# Altium project PROC154E3_SCH.PrjPcb (part 16 of 60)
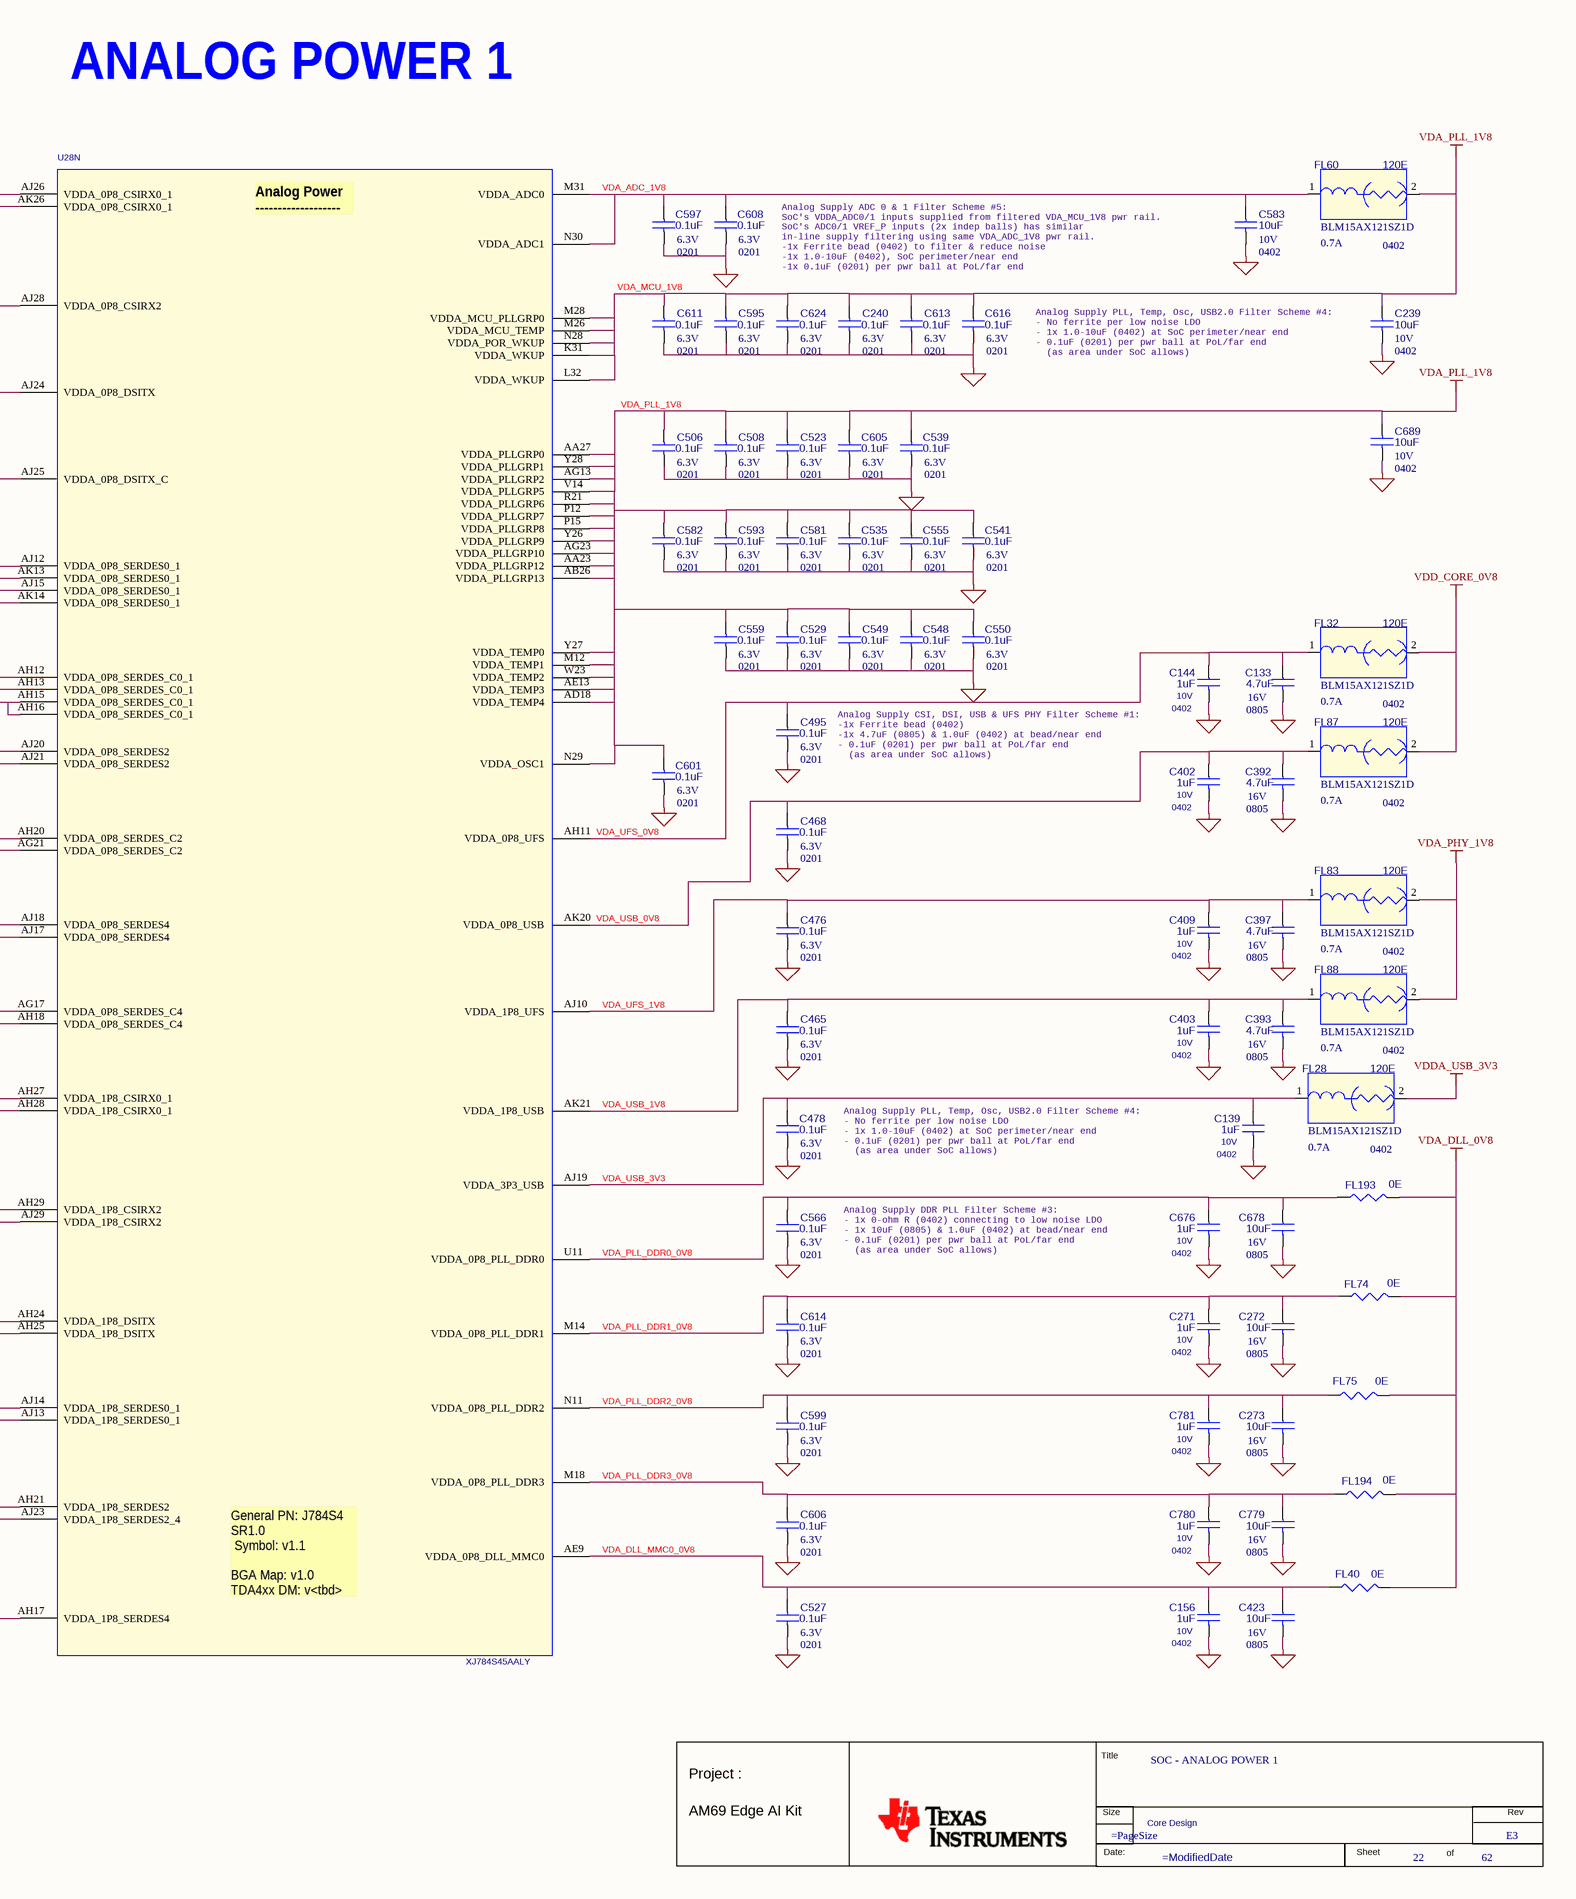
[diagram p207: 22. SOC ANALOG POWER 1.SchDoc, right]

## Sheet 22. SOC ANALOG POWER 1.SchDoc: SOC - ANALOG POWER 1 (continued)

### Library data of the parts (continued)
C616 = CAP_Dup1: CAP CERAMIC 0.1uF 6.3V 10% X7S AUTO 0201; Part Reference: C616; Mistral Part No: 120018100001-R; Mfr_name: MURATA; Mfr_part_number: GCM033C70J104KE02D; Part_type: CAPACITORS\CERAMIC; Project: TI_J7_SVB-DUT; Wattage: NA; Customs_HS_Code: 85322990; Custom_Duty: 15%; Value: 0.1uF; PCB Footprint: CAP0201_0-5; Footprint Ref: CAP0201_0-5; Tolerance: 10%; Distributor_name: NA; Distributor_part_number: NA; Library Ref: CAP; Height: 0.33MM; Weight: NA; Temperature: -55°C+125°C; Datasheet: Y:\MIS_DATABASE\DATASHEETS\CAPACITORS\MURATA-GCM-SER.PDF; Crtd /date: MANIRAJA/011018; Chkd/date: MANIRAJA/011018; MECHANICAL 3D STEP FILE: CAP0201_0-5; Library Path: Y:\MIS_DATABASE\Library\ALTIUM_TOOL\SCHEMATICS_PARTS\MS_DISCRETE_Library.schlib; Footprint Path: Y:\MIS_DATABASE\Library\ALTIUM_TOOL\PCB_FOOTPRINTS\Altium_Footprint_Lib.PcbLib; Manufacturer: MURATA
C624 = CAP_Dup1: CAP CERAMIC 0.1uF 6.3V 10% X7S AUTO 0201; Part Reference: C624; Part_type: CAPACITORS\CERAMIC; Mfr_part_number: GCM033C70J104KE02D; Mfr_name: MURATA; Mistral Part No: 120018100001-R; Custom_Duty: 15%; Customs_HS_Code: 85322990; Wattage: NA; Project: TI_J7_SVB-DUT; Value: 0.1uF; PCB Footprint: CAP0201_0-5; Footprint Path: Y:\MIS_DATABASE\Library\ALTIUM_TOOL\PCB_FOOTPRINTS\Altium_Footprint_Lib.PcbLib; Library Path: Y:\MIS_DATABASE\Library\ALTIUM_TOOL\SCHEMATICS_PARTS\MS_DISCRETE_Library.schlib; MECHANICAL 3D STEP FILE: CAP0201_0-5; Chkd/date: MANIRAJA/011018; Crtd /date: MANIRAJA/011018; Datasheet: Y:\MIS_DATABASE\DATASHEETS\CAPACITORS\MURATA-GCM-SER.PDF; Temperature: -55°C+125°C; Weight: NA; Height: 0.33MM; Library Ref: CAP; Distributor_part_number: NA; Distributor_name: NA; Tolerance: 10%; Footprint Ref: CAP0201_0-5; Manufacturer: MURATA
C676 = CAP_Dup1: CAP CERAMIC 1uF 10V 10% X7S AUTO 0402; Part Reference: C676; Mistral Part No: 120018090021-R; Mfr_name: MURATA; Mfr_part_number: GCM155C71A105KE38D; Part_type: CAPACITORS\CERAMIC; Project: SMART-M_SCRIPTALK_PB; Wattage: NA; Customs_HS_Code: 85322990; Custom_Duty: 15%; Value: 1uF; PCB Footprint: CAP0402_0-75; Footprint Ref: CAP0402_0-75; Tolerance: 10%; Distributor_name: DIGIKEY; Distributor_part_number: 490-13409-1-ND; Library Ref: CAP; Height: 0.70MM; Weight: 6mg; Temperature: -55°C+125°C; Datasheet: Y:\MIS_DATABASE\DATASHEETS\CAPACITORS\MURATA-GCM-SER.PDF; Crtd /date: ALVY/100918; Chkd/date: MANIRAJA/100918; MECHANICAL 3D STEP FILE: CAP0402_0-75; Library Path: Y:\MIS_DATABASE\Library\ALTIUM_TOOL\SCHEMATICS_PARTS\MS_DISCRETE_Library.schlib; Footprint Path: Y:\MIS_DATABASE\Library\ALTIUM_TOOL\PCB_FOOTPRINTS\Altium_Footprint_Lib.PcbLib; Manufacturer: MURATA
C678 = CAP_Dup1: CAP CERAMIC 10uF 16V 10% X5R 0805; Part Reference: C678; Direct Alternate_mfr_part_number: C2012X7S1C106K125AC; Direct Alternate_mfr_name: TDK; Automotive Alternate_mfr_part_number: CGA4J1X7S1C106K125AC; Mistral Part No: 120009030205-R; Mfr_name: MURATA; Mfr_part_number: GRM21BR61C106KE15L; Part_type: CAPACITORS\CERAMIC; Project: VOCERA; Wattage: NA; Customs_HS_Code: 85322990; Custom_Duty: 15%; Value: 10uF; PCB Footprint: CAP0805_1-5; Automotive Alternate_mfr_name: TDK; Footprint Ref: CAP0805_1-25; Tolerance: 10%; Distributor_name: DIGIKEY; Distributor_part_number: 490-3886-1-ND; Library Ref: CAP; Height: 1.35MM; Weight: 9.5mg; Temperature: -55°C+85°C; Datasheet: Y:\MIS_DATABASE\DATASHEETS\CAPACITORS\MURATA-GXX-SER_NOV17.PDF; Crtd /date: MAZHAR/150506; Chkd/date: SHREESHAIL/220506; MECHANICAL 3D STEP FILE: CAP0805_1-5; Library Path: Y:\MIS_DATABASE\Library\ALTIUM_TOOL\SCHEMATICS_PARTS\MS_DISCRETE_Library.schlib; Footprint Path: Y:\MIS_DATABASE\Library\ALTIUM_TOOL\PCB_FOOTPRINTS\Altium_Footprint_Lib.PcbLib; Manufacturer: MURATA
C689 = CAP_Dup1: CAP CERAMIC 10uF 10V 20% X5R 0402; Part Reference: C689; Part_type: CAPACITORS\CERAMIC; Mfr_part_number: GRM155R61A106ME11D; Mfr_name: MURATA; Mistral Part No: 120013110019-R; Custom_Duty: 15%; Customs_HS_Code: 85322990; Wattage: NA; Project: QCS610_NANOSOM; Value: 10uF; PCB Footprint: CAP0402_0-75; Footprint Path: Y:\MIS_DATABASE\Library\ALTIUM_TOOL\PCB_FOOTPRINTS\Altium_Footprint_Lib.PcbLib; Library Path: Y:\MIS_DATABASE\Library\ALTIUM_TOOL\SCHEMATICS_PARTS\MS_DISCRETE_Library.schlib; MECHANICAL 3D STEP FILE: CAP0402_0-75; Chkd/date: MANIRAJA/300520; Crtd /date: ALVY/260520; Datasheet: Y:\MIS_DATABASE\DATASHEETS\CAPACITORS\MURATA-GXX-SER_NOV17.PDF; Temperature: -55°C+85°C; Weight: 3.1mg; Height: 0.55MM; Library Ref: CAP; Distributor_part_number: 490-GRM155R61A106ME11DTR-ND; Distributor_name: DIGIKEY; Tolerance: 20%; Footprint Ref: CAP0402_0-75; Manufacturer: MURATA
C779 = CAP_Dup1: CAP CERAMIC 10uF 16V 10% X5R 0805; Part Reference: C779; Direct Alternate_mfr_part_number: C2012X7S1C106K125AC; Direct Alternate_mfr_name: TDK; Automotive Alternate_mfr_part_number: CGA4J1X7S1C106K125AC; Mistral Part No: 120009030205-R; Mfr_name: MURATA; Mfr_part_number: GRM21BR61C106KE15L; Part_type: CAPACITORS\CERAMIC; Project: VOCERA; Wattage: NA; Customs_HS_Code: 85322990; Custom_Duty: 15%; Value: 10uF; PCB Footprint: CAP0805_1-5; Automotive Alternate_mfr_name: TDK; Footprint Ref: CAP0805_1-25; Tolerance: 10%; Distributor_name: DIGIKEY; Distributor_part_number: 490-3886-1-ND; Library Ref: CAP; Height: 1.35MM; Weight: 9.5mg; Temperature: -55°C+85°C; Datasheet: Y:\MIS_DATABASE\DATASHEETS\CAPACITORS\MURATA-GXX-SER_NOV17.PDF; Crtd /date: MAZHAR/150506; Chkd/date: SHREESHAIL/220506; MECHANICAL 3D STEP FILE: CAP0805_1-5; Library Path: Y:\MIS_DATABASE\Library\ALTIUM_TOOL\SCHEMATICS_PARTS\MS_DISCRETE_Library.schlib; Footprint Path: Y:\MIS_DATABASE\Library\ALTIUM_TOOL\PCB_FOOTPRINTS\Altium_Footprint_Lib.PcbLib; Manufacturer: MURATA
C780 = CAP_Dup1: CAP CERAMIC 1uF 10V 10% X7S AUTO 0402; Part Reference: C780; Part_type: CAPACITORS\CERAMIC; Mfr_part_number: GCM155C71A105KE38D; Mfr_name: MURATA; Mistral Part No: 120018090021-R; Custom_Duty: 15%; Customs_HS_Code: 85322990; Wattage: NA; Project: SMART-M_SCRIPTALK_PB; Value: 1uF; PCB Footprint: CAP0402_0-75; Footprint Path: Y:\MIS_DATABASE\Library\ALTIUM_TOOL\PCB_FOOTPRINTS\Altium_Footprint_Lib.PcbLib; Library Path: Y:\MIS_DATABASE\Library\ALTIUM_TOOL\SCHEMATICS_PARTS\MS_DISCRETE_Library.schlib; MECHANICAL 3D STEP FILE: CAP0402_0-75; Chkd/date: MANIRAJA/100918; Crtd /date: ALVY/100918; Datasheet: Y:\MIS_DATABASE\DATASHEETS\CAPACITORS\MURATA-GCM-SER.PDF; Temperature: -55°C+125°C; Weight: 6mg; Height: 0.70MM; Library Ref: CAP; Distributor_part_number: 490-13409-1-ND; Distributor_name: DIGIKEY; Tolerance: 10%; Footprint Ref: CAP0402_0-75; Manufacturer: MURATA
C781 = CAP_Dup1: CAP CERAMIC 1uF 10V 10% X7S AUTO 0402; Part Reference: C781; Mistral Part No: 120018090021-R; Mfr_name: MURATA; Mfr_part_number: GCM155C71A105KE38D; Part_type: CAPACITORS\CERAMIC; Project: SMART-M_SCRIPTALK_PB; Wattage: NA; Customs_HS_Code: 85322990; Custom_Duty: 15%; Value: 1uF; PCB Footprint: CAP0402_0-75; Footprint Ref: CAP0402_0-75; Tolerance: 10%; Distributor_name: DIGIKEY; Distributor_part_number: 490-13409-1-ND; Library Ref: CAP; Height: 0.70MM; Weight: 6mg; Temperature: -55°C+125°C; Datasheet: Y:\MIS_DATABASE\DATASHEETS\CAPACITORS\MURATA-GCM-SER.PDF; Crtd /date: ALVY/100918; Chkd/date: MANIRAJA/100918; MECHANICAL 3D STEP FILE: CAP0402_0-75; Library Path: Y:\MIS_DATABASE\Library\ALTIUM_TOOL\SCHEMATICS_PARTS\MS_DISCRETE_Library.schlib; Footprint Path: Y:\MIS_DATABASE\Library\ALTIUM_TOOL\PCB_FOOTPRINTS\Altium_Footprint_Lib.PcbLib; Manufacturer: MURATA
FL23 = EMIFILTER_IND: IND FERRITE BEAD CHIP 120E 700mA 0402; Part Reference: FL23; Automotive Alternate_mfr_part_number: MPZ1608S121ATDH5; Automotive Alternate_mfr_name: TDK; Direct Alternate_mfr_part_number: MPZ1608S121ATAH0; Mistral Part No: 130022010017-R; Mfr_name: MURATA; Part_type: INDUCTOR; Project: J7AHP_PROTO_BRD; Tolerance: 25%; Voltage: NA; Customs_HS_Code: 85437099; Custom_Duty: 24%; Value: 120E; PCB Footprint: EMIFIL_BLM15A_0402_0-6; Direct Alternate_mfr_name: TDK; Footprint Ref: EMIFIL_BLM15A_0402_0-6; Wattage: NA; Distributor_name: DIGIKEY; Distributor_part_number: 490-16510-1-ND; Library Ref: EMIFILTER_IND; Height: 0.55MM; Weight: 1mg; Temperature: -55°C+125°C; Datasheet: Y:\MIS_DATABASE\DATASHEETS\DISCRETES\INDUCTORS\BLM15-SZ1D-SER.PDF; Crtd /date: TAMILARASU/170122; Chkd/date: MANIRAJA/170122; MECHANICAL 3D STEP FILE: EMIFIL_BLM15A_0402_0-6; Library Path: Y:\MIS_DATABASE\Library\ALTIUM_TOOL\SCHEMATICS_PARTS\MS_FILTER_Library.schlib; Footprint Path: Y:\MIS_DATABASE\Library\ALTIUM_TOOL\PCB_FOOTPRINTS\Altium_Footprint_Lib.PcbLib; Manufacturer: MURATA
FL24 = EMIFILTER_IND: IND FERRITE BEAD CHIP 120E 700mA 0402; Part Reference: FL24; Part_type: INDUCTOR; Mfr_name: MURATA; Mistral Part No: 130022010017-R; Direct Alternate_mfr_name: TDK; Direct Alternate_mfr_part_number: MPZ1608S121ATAH0; Automotive Alternate_mfr_part_number: MPZ1608S121ATDH5; Custom_Duty: 24%; Customs_HS_Code: 85437099; Wattage: NA; Tolerance: 25%; Project: J7AHP_PROTO_BRD; Value: 120E; PCB Footprint: EMIFIL_BLM15A_0402_0-6; Footprint Path: Y:\MIS_DATABASE\Library\ALTIUM_TOOL\PCB_FOOTPRINTS\Altium_Footprint_Lib.PcbLib; Library Path: Y:\MIS_DATABASE\Library\ALTIUM_TOOL\SCHEMATICS_PARTS\MS_FILTER_Library.schlib; MECHANICAL 3D STEP FILE: EMIFIL_BLM15A_0402_0-6; Chkd/date: MANIRAJA/170122; Crtd /date: TAMILARASU/170122; Datasheet: Y:\MIS_DATABASE\DATASHEETS\DISCRETES\INDUCTORS\BLM15-SZ1D-SER.PDF; Temperature: -55°C+125°C; Weight: 1mg; Height: 0.55MM; Library Ref: EMIFILTER_IND; Distributor_part_number: 490-16510-1-ND; Distributor_name: DIGIKEY; Voltage: NA; Footprint Ref: EMIFIL_BLM15A_0402_0-6; Automotive Alternate_mfr_name: TDK; Manufacturer: MURATA
FL25 = EMIFILTER_IND: IND FERRITE BEAD CHIP 120E 700mA 0402; Part Reference: FL25; Automotive Alternate_mfr_part_number: MPZ1608S121ATDH5; Automotive Alternate_mfr_name: TDK; Direct Alternate_mfr_part_number: MPZ1608S121ATAH0; Mistral Part No: 130022010017-R; Mfr_name: MURATA; Part_type: INDUCTOR; Project: J7AHP_PROTO_BRD; Tolerance: 25%; Voltage: NA; Customs_HS_Code: 85437099; Custom_Duty: 24%; Value: 120E; PCB Footprint: EMIFIL_BLM15A_0402_0-6; Direct Alternate_mfr_name: TDK; Footprint Ref: EMIFIL_BLM15A_0402_0-6; Wattage: NA; Distributor_name: DIGIKEY; Distributor_part_number: 490-16510-1-ND; Library Ref: EMIFILTER_IND; Height: 0.55MM; Weight: 1mg; Temperature: -55°C+125°C; Datasheet: Y:\MIS_DATABASE\DATASHEETS\DISCRETES\INDUCTORS\BLM15-SZ1D-SER.PDF; Crtd /date: TAMILARASU/170122; Chkd/date: MANIRAJA/170122; MECHANICAL 3D STEP FILE: EMIFIL_BLM15A_0402_0-6; Library Path: Y:\MIS_DATABASE\Library\ALTIUM_TOOL\SCHEMATICS_PARTS\MS_FILTER_Library.schlib; Footprint Path: Y:\MIS_DATABASE\Library\ALTIUM_TOOL\PCB_FOOTPRINTS\Altium_Footprint_Lib.PcbLib; Manufacturer: MURATA
FL26 = EMIFILTER_IND: IND FERRITE BEAD CHIP 120E 700mA 0402; Part Reference: FL26; Automotive Alternate_mfr_part_number: MPZ1608S121ATDH5; Automotive Alternate_mfr_name: TDK; Direct Alternate_mfr_part_number: MPZ1608S121ATAH0; Mistral Part No: 130022010017-R; Mfr_name: MURATA; Part_type: INDUCTOR; Project: J7AHP_PROTO_BRD; Tolerance: 25%; Voltage: NA; Customs_HS_Code: 85437099; Custom_Duty: 24%; Value: 120E; PCB Footprint: EMIFIL_BLM15A_0402_0-6; Direct Alternate_mfr_name: TDK; Footprint Ref: EMIFIL_BLM15A_0402_0-6; Wattage: NA; Distributor_name: DIGIKEY; Distributor_part_number: 490-16510-1-ND; Library Ref: EMIFILTER_IND; Height: 0.55MM; Weight: 1mg; Temperature: -55°C+125°C; Datasheet: Y:\MIS_DATABASE\DATASHEETS\DISCRETES\INDUCTORS\BLM15-SZ1D-SER.PDF; Crtd /date: TAMILARASU/170122; Chkd/date: MANIRAJA/170122; MECHANICAL 3D STEP FILE: EMIFIL_BLM15A_0402_0-6; Library Path: Y:\MIS_DATABASE\Library\ALTIUM_TOOL\SCHEMATICS_PARTS\MS_FILTER_Library.schlib; Footprint Path: Y:\MIS_DATABASE\Library\ALTIUM_TOOL\PCB_FOOTPRINTS\Altium_Footprint_Lib.PcbLib; Manufacturer: MURATA
FL27 = EMIFILTER_IND: IND FERRITE BEAD CHIP 120E 700mA 0402; Part Reference: FL27; Automotive Alternate_mfr_part_number: MPZ1608S121ATDH5; Automotive Alternate_mfr_name: TDK; Direct Alternate_mfr_part_number: MPZ1608S121ATAH0; Mistral Part No: 130022010017-R; Mfr_name: MURATA; Part_type: INDUCTOR; Project: J7AHP_PROTO_BRD; Tolerance: 25%; Voltage: NA; Customs_HS_Code: 85437099; Custom_Duty: 24%; Value: 120E; PCB Footprint: EMIFIL_BLM15A_0402_0-6; Direct Alternate_mfr_name: TDK; Footprint Ref: EMIFIL_BLM15A_0402_0-6; Wattage: NA; Distributor_name: DIGIKEY; Distributor_part_number: 490-16510-1-ND; Library Ref: EMIFILTER_IND; Height: 0.55MM; Weight: 1mg; Temperature: -55°C+125°C; Datasheet: Y:\MIS_DATABASE\DATASHEETS\DISCRETES\INDUCTORS\BLM15-SZ1D-SER.PDF; Crtd /date: TAMILARASU/170122; Chkd/date: MANIRAJA/170122; MECHANICAL 3D STEP FILE: EMIFIL_BLM15A_0402_0-6; Library Path: Y:\MIS_DATABASE\Library\ALTIUM_TOOL\SCHEMATICS_PARTS\MS_FILTER_Library.schlib; Footprint Path: Y:\MIS_DATABASE\Library\ALTIUM_TOOL\PCB_FOOTPRINTS\Altium_Footprint_Lib.PcbLib; Manufacturer: MURATA
FL28 = EMIFILTER_IND: IND FERRITE BEAD CHIP 120E 700mA 0402; Part Reference: FL28; Automotive Alternate_mfr_part_number: MPZ1608S121ATDH5; Automotive Alternate_mfr_name: TDK; Direct Alternate_mfr_part_number: MPZ1608S121ATAH0; Mistral Part No: 130022010017-R; Mfr_name: MURATA; Part_type: INDUCTOR; Project: J7AHP_PROTO_BRD; Tolerance: 25%; Voltage: NA; Customs_HS_Code: 85437099; Custom_Duty: 24%; Value: 120E; PCB Footprint: EMIFIL_BLM15A_0402_0-6; Direct Alternate_mfr_name: TDK; Footprint Ref: EMIFIL_BLM15A_0402_0-6; Wattage: NA; Distributor_name: DIGIKEY; Distributor_part_number: 490-16510-1-ND; Library Ref: EMIFILTER_IND; Height: 0.55MM; Weight: 1mg; Temperature: -55°C+125°C; Datasheet: Y:\MIS_DATABASE\DATASHEETS\DISCRETES\INDUCTORS\BLM15-SZ1D-SER.PDF; Crtd /date: TAMILARASU/170122; Chkd/date: MANIRAJA/170122; MECHANICAL 3D STEP FILE: EMIFIL_BLM15A_0402_0-6; Library Path: Y:\MIS_DATABASE\Library\ALTIUM_TOOL\SCHEMATICS_PARTS\MS_FILTER_Library.schlib; Footprint Path: Y:\MIS_DATABASE\Library\ALTIUM_TOOL\PCB_FOOTPRINTS\Altium_Footprint_Lib.PcbLib; Manufacturer: MURATA
FL29 = EMIFILTER_IND: IND FERRITE BEAD CHIP 120E 700mA 0402; Part Reference: FL29; Automotive Alternate_mfr_part_number: MPZ1608S121ATDH5; Automotive Alternate_mfr_name: TDK; Direct Alternate_mfr_part_number: MPZ1608S121ATAH0; Mistral Part No: 130022010017-R; Mfr_name: MURATA; Part_type: INDUCTOR; Project: J7AHP_PROTO_BRD; Tolerance: 25%; Voltage: NA; Customs_HS_Code: 85437099; Custom_Duty: 24%; Value: 120E; PCB Footprint: EMIFIL_BLM15A_0402_0-6; Direct Alternate_mfr_name: TDK; Footprint Ref: EMIFIL_BLM15A_0402_0-6; Wattage: NA; Distributor_name: DIGIKEY; Distributor_part_number: 490-16510-1-ND; Library Ref: EMIFILTER_IND; Height: 0.55MM; Weight: 1mg; Temperature: -55°C+125°C; Datasheet: Y:\MIS_DATABASE\DATASHEETS\DISCRETES\INDUCTORS\BLM15-SZ1D-SER.PDF; Crtd /date: TAMILARASU/170122; Chkd/date: MANIRAJA/170122; MECHANICAL 3D STEP FILE: EMIFIL_BLM15A_0402_0-6; Library Path: Y:\MIS_DATABASE\Library\ALTIUM_TOOL\SCHEMATICS_PARTS\MS_FILTER_Library.schlib; Footprint Path: Y:\MIS_DATABASE\Library\ALTIUM_TOOL\PCB_FOOTPRINTS\Altium_Footprint_Lib.PcbLib; Manufacturer: MURATA
FL30 = EMIFILTER_IND: IND FERRITE BEAD CHIP 120E 700mA 0402; Part Reference: FL30; Part_type: INDUCTOR; Mfr_name: MURATA; Mistral Part No: 130022010017-R; Direct Alternate_mfr_name: TDK; Direct Alternate_mfr_part_number: MPZ1608S121ATAH0; Automotive Alternate_mfr_part_number: MPZ1608S121ATDH5; Custom_Duty: 24%; Customs_HS_Code: 85437099; Wattage: NA; Tolerance: 25%; Project: J7AHP_PROTO_BRD; Value: 120E; PCB Footprint: EMIFIL_BLM15A_0402_0-6; Footprint Path: Y:\MIS_DATABASE\Library\ALTIUM_TOOL\PCB_FOOTPRINTS\Altium_Footprint_Lib.PcbLib; Library Path: Y:\MIS_DATABASE\Library\ALTIUM_TOOL\SCHEMATICS_PARTS\MS_FILTER_Library.schlib; MECHANICAL 3D STEP FILE: EMIFIL_BLM15A_0402_0-6; Chkd/date: MANIRAJA/170122; Crtd /date: TAMILARASU/170122; Datasheet: Y:\MIS_DATABASE\DATASHEETS\DISCRETES\INDUCTORS\BLM15-SZ1D-SER.PDF; Temperature: -55°C+125°C; Weight: 1mg; Height: 0.55MM; Library Ref: EMIFILTER_IND; Distributor_part_number: 490-16510-1-ND; Distributor_name: DIGIKEY; Voltage: NA; Footprint Ref: EMIFIL_BLM15A_0402_0-6; Automotive Alternate_mfr_name: TDK; Manufacturer: MURATA
FL31 = EMIFILTER_IND: IND FERRITE BEAD CHIP 120E 700mA 0402; Part Reference: FL31; Part_type: INDUCTOR; Mfr_name: MURATA; Mistral Part No: 130022010017-R; Direct Alternate_mfr_name: TDK; Direct Alternate_mfr_part_number: MPZ1608S121ATAH0; Automotive Alternate_mfr_part_number: MPZ1608S121ATDH5; Custom_Duty: 24%; Customs_HS_Code: 85437099; Wattage: NA; Tolerance: 25%; Project: J7AHP_PROTO_BRD; Value: 120E; PCB Footprint: EMIFIL_BLM15A_0402_0-6; Footprint Path: Y:\MIS_DATABASE\Library\ALTIUM_TOOL\PCB_FOOTPRINTS\Altium_Footprint_Lib.PcbLib; Library Path: Y:\MIS_DATABASE\Library\ALTIUM_TOOL\SCHEMATICS_PARTS\MS_FILTER_Library.schlib; MECHANICAL 3D STEP FILE: EMIFIL_BLM15A_0402_0-6; Chkd/date: MANIRAJA/170122; Crtd /date: TAMILARASU/170122; Datasheet: Y:\MIS_DATABASE\DATASHEETS\DISCRETES\INDUCTORS\BLM15-SZ1D-SER.PDF; Temperature: -55°C+125°C; Weight: 1mg; Height: 0.55MM; Library Ref: EMIFILTER_IND; Distributor_part_number: 490-16510-1-ND; Distributor_name: DIGIKEY; Voltage: NA; Footprint Ref: EMIFIL_BLM15A_0402_0-6; Automotive Alternate_mfr_name: TDK; Manufacturer: MURATA
FL32 = EMIFILTER_IND: IND FERRITE BEAD CHIP 120E 700mA 0402; Part Reference: FL32; Part_type: INDUCTOR; Mfr_name: MURATA; Mistral Part No: 130022010017-R; Direct Alternate_mfr_name: TDK; Direct Alternate_mfr_part_number: MPZ1608S121ATAH0; Automotive Alternate_mfr_part_number: MPZ1608S121ATDH5; Custom_Duty: 24%; Customs_HS_Code: 85437099; Wattage: NA; Tolerance: 25%; Project: J7AHP_PROTO_BRD; Value: 120E; PCB Footprint: EMIFIL_BLM15A_0402_0-6; Footprint Path: Y:\MIS_DATABASE\Library\ALTIUM_TOOL\PCB_FOOTPRINTS\Altium_Footprint_Lib.PcbLib; Library Path: Y:\MIS_DATABASE\Library\ALTIUM_TOOL\SCHEMATICS_PARTS\MS_FILTER_Library.schlib; MECHANICAL 3D STEP FILE: EMIFIL_BLM15A_0402_0-6; Chkd/date: MANIRAJA/170122; Crtd /date: TAMILARASU/170122; Datasheet: Y:\MIS_DATABASE\DATASHEETS\DISCRETES\INDUCTORS\BLM15-SZ1D-SER.PDF; Temperature: -55°C+125°C; Weight: 1mg; Height: 0.55MM; Library Ref: EMIFILTER_IND; Distributor_part_number: 490-16510-1-ND; Distributor_name: DIGIKEY; Voltage: NA; Footprint Ref: EMIFIL_BLM15A_0402_0-6; Automotive Alternate_mfr_name: TDK; Manufacturer: MURATA
FL40 = RESISTOR_Dup2: RES 0E 1/10W JUMPER 0402; Part Reference: FL40; Part_type: RESISTORS\FIXED; Mfr_part_number: ERJ-2GE0R00X; Mfr_name: PANASONIC-ECG; Mistral Part No: 110018030052-R; Custom_Duty: 15%; Customs_HS_Code: 85332119; Voltage: NA; Project: AEGIS POM; Value: 0E; MECHANICAL 3D STEP FILE: RES0402_0-5; Chkd/date: VASANTHA/061216; Crtd /date: NAVEED/201014; Datasheet: Y:\MIS_DATABASE\DATASHEETS\RESISTORS\PAN-ERJSER_NOV17.PDF; Temperature: -55°C+155°C; Weight: 0.8mg; Height: 0.40MM; Distributor_part_number: P0.0JCT-ND; Distributor_name: DIGIKEY; Package: 0402; Wattage: 1/10W; Tolerance: NA; PCB Footprint: RES0402_0-5
FL60 = EMIFILTER_IND: IND FERRITE BEAD CHIP 120E 700mA 0402; Part Reference: FL60; Part_type: INDUCTOR; Mfr_name: MURATA; Mistral Part No: 130022010017-R; Direct Alternate_mfr_name: TDK; Direct Alternate_mfr_part_number: MPZ1608S121ATAH0; Automotive Alternate_mfr_part_number: MPZ1608S121ATDH5; Custom_Duty: 24%; Customs_HS_Code: 85437099; Wattage: NA; Tolerance: 25%; Project: J7AHP_PROTO_BRD; Value: 120E; PCB Footprint: EMIFIL_BLM15A_0402_0-6; Footprint Path: Y:\MIS_DATABASE\Library\ALTIUM_TOOL\PCB_FOOTPRINTS\Altium_Footprint_Lib.PcbLib; Library Path: Y:\MIS_DATABASE\Library\ALTIUM_TOOL\SCHEMATICS_PARTS\MS_FILTER_Library.schlib; MECHANICAL 3D STEP FILE: EMIFIL_BLM15A_0402_0-6; Chkd/date: MANIRAJA/170122; Crtd /date: TAMILARASU/170122; Datasheet: Y:\MIS_DATABASE\DATASHEETS\DISCRETES\INDUCTORS\BLM15-SZ1D-SER.PDF; Temperature: -55°C+125°C; Weight: 1mg; Height: 0.55MM; Library Ref: EMIFILTER_IND; Distributor_part_number: 490-16510-1-ND; Distributor_name: DIGIKEY; Voltage: NA; Footprint Ref: EMIFIL_BLM15A_0402_0-6; Automotive Alternate_mfr_name: TDK; Manufacturer: MURATA
FL74 = RESISTOR_Dup2: RES 0E 1/10W JUMPER 0402; Part Reference: FL74; Mistral Part No: 110018030052-R; Mfr_name: PANASONIC-ECG; Mfr_part_number: ERJ-2GE0R00X; Part_type: RESISTORS\FIXED; Project: AEGIS POM; Tolerance: NA; Customs_HS_Code: 85332119; Custom_Duty: 15%; Value: 0E; Voltage: NA; Wattage: 1/10W; Package: 0402; Distributor_name: DIGIKEY; Distributor_part_number: P0.0JCT-ND; Height: 0.40MM; Weight: 0.8mg; Temperature: -55°C+155°C; Datasheet: Y:\MIS_DATABASE\DATASHEETS\RESISTORS\PAN-ERJSER_NOV17.PDF; Crtd /date: NAVEED/201014; Chkd/date: VASANTHA/061216; MECHANICAL 3D STEP FILE: RES0402_0-5; PCB Footprint: RES0402_0-5
FL75 = RESISTOR_Dup2: RES 0E 1/10W JUMPER 0402; Part Reference: FL75; Mistral Part No: 110018030052-R; Mfr_name: PANASONIC-ECG; Mfr_part_number: ERJ-2GE0R00X; Part_type: RESISTORS\FIXED; Project: AEGIS POM; Tolerance: NA; Customs_HS_Code: 85332119; Custom_Duty: 15%; Value: 0E; Voltage: NA; Wattage: 1/10W; Package: 0402; Distributor_name: DIGIKEY; Distributor_part_number: P0.0JCT-ND; Height: 0.40MM; Weight: 0.8mg; Temperature: -55°C+155°C; Datasheet: Y:\MIS_DATABASE\DATASHEETS\RESISTORS\PAN-ERJSER_NOV17.PDF; Crtd /date: NAVEED/201014; Chkd/date: VASANTHA/061216; MECHANICAL 3D STEP FILE: RES0402_0-5; PCB Footprint: RES0402_0-5
FL83 = EMIFILTER_IND: IND FERRITE BEAD CHIP 120E 700mA 0402; Part Reference: FL83; Automotive Alternate_mfr_part_number: MPZ1608S121ATDH5; Automotive Alternate_mfr_name: TDK; Direct Alternate_mfr_part_number: MPZ1608S121ATAH0; Mistral Part No: 130022010017-R; Mfr_name: MURATA; Part_type: INDUCTOR; Project: J7AHP_PROTO_BRD; Tolerance: 25%; Voltage: NA; Customs_HS_Code: 85437099; Custom_Duty: 24%; Value: 120E; PCB Footprint: EMIFIL_BLM15A_0402_0-6; Direct Alternate_mfr_name: TDK; Footprint Ref: EMIFIL_BLM15A_0402_0-6; Wattage: NA; Distributor_name: DIGIKEY; Distributor_part_number: 490-16510-1-ND; Library Ref: EMIFILTER_IND; Height: 0.55MM; Weight: 1mg; Temperature: -55°C+125°C; Datasheet: Y:\MIS_DATABASE\DATASHEETS\DISCRETES\INDUCTORS\BLM15-SZ1D-SER.PDF; Crtd /date: TAMILARASU/170122; Chkd/date: MANIRAJA/170122; MECHANICAL 3D STEP FILE: EMIFIL_BLM15A_0402_0-6; Library Path: Y:\MIS_DATABASE\Library\ALTIUM_TOOL\SCHEMATICS_PARTS\MS_FILTER_Library.schlib; Footprint Path: Y:\MIS_DATABASE\Library\ALTIUM_TOOL\PCB_FOOTPRINTS\Altium_Footprint_Lib.PcbLib; Manufacturer: MURATA
FL84 = EMIFILTER_IND: IND FERRITE BEAD CHIP 120E 700mA 0402; Part Reference: FL84; Part_type: INDUCTOR; Mfr_name: MURATA; Mistral Part No: 130022010017-R; Direct Alternate_mfr_name: TDK; Direct Alternate_mfr_part_number: MPZ1608S121ATAH0; Automotive Alternate_mfr_part_number: MPZ1608S121ATDH5; Custom_Duty: 24%; Customs_HS_Code: 85437099; Wattage: NA; Tolerance: 25%; Project: J7AHP_PROTO_BRD; Value: 120E; PCB Footprint: EMIFIL_BLM15A_0402_0-6; Footprint Path: Y:\MIS_DATABASE\Library\ALTIUM_TOOL\PCB_FOOTPRINTS\Altium_Footprint_Lib.PcbLib; Library Path: Y:\MIS_DATABASE\Library\ALTIUM_TOOL\SCHEMATICS_PARTS\MS_FILTER_Library.schlib; MECHANICAL 3D STEP FILE: EMIFIL_BLM15A_0402_0-6; Chkd/date: MANIRAJA/170122; Crtd /date: TAMILARASU/170122; Datasheet: Y:\MIS_DATABASE\DATASHEETS\DISCRETES\INDUCTORS\BLM15-SZ1D-SER.PDF; Temperature: -55°C+125°C; Weight: 1mg; Height: 0.55MM; Library Ref: EMIFILTER_IND; Distributor_part_number: 490-16510-1-ND; Distributor_name: DIGIKEY; Voltage: NA; Footprint Ref: EMIFIL_BLM15A_0402_0-6; Automotive Alternate_mfr_name: TDK; Manufacturer: MURATA
FL85 = EMIFILTER_IND: IND FERRITE BEAD CHIP 120E 700mA 0402; Part Reference: FL85; Part_type: INDUCTOR; Mfr_name: MURATA; Mistral Part No: 130022010017-R; Direct Alternate_mfr_name: TDK; Direct Alternate_mfr_part_number: MPZ1608S121ATAH0; Automotive Alternate_mfr_part_number: MPZ1608S121ATDH5; Custom_Duty: 24%; Customs_HS_Code: 85437099; Wattage: NA; Tolerance: 25%; Project: J7AHP_PROTO_BRD; Value: 120E; PCB Footprint: EMIFIL_BLM15A_0402_0-6; Footprint Path: Y:\MIS_DATABASE\Library\ALTIUM_TOOL\PCB_FOOTPRINTS\Altium_Footprint_Lib.PcbLib; Library Path: Y:\MIS_DATABASE\Library\ALTIUM_TOOL\SCHEMATICS_PARTS\MS_FILTER_Library.schlib; MECHANICAL 3D STEP FILE: EMIFIL_BLM15A_0402_0-6; Chkd/date: MANIRAJA/170122; Crtd /date: TAMILARASU/170122; Datasheet: Y:\MIS_DATABASE\DATASHEETS\DISCRETES\INDUCTORS\BLM15-SZ1D-SER.PDF; Temperature: -55°C+125°C; Weight: 1mg; Height: 0.55MM; Library Ref: EMIFILTER_IND; Distributor_part_number: 490-16510-1-ND; Distributor_name: DIGIKEY; Voltage: NA; Footprint Ref: EMIFIL_BLM15A_0402_0-6; Automotive Alternate_mfr_name: TDK; Manufacturer: MURATA
FL86 = EMIFILTER_IND: IND FERRITE BEAD CHIP 120E 700mA 0402; Part Reference: FL86; Part_type: INDUCTOR; Mfr_name: MURATA; Mistral Part No: 130022010017-R; Direct Alternate_mfr_name: TDK; Direct Alternate_mfr_part_number: MPZ1608S121ATAH0; Automotive Alternate_mfr_part_number: MPZ1608S121ATDH5; Custom_Duty: 24%; Customs_HS_Code: 85437099; Wattage: NA; Tolerance: 25%; Project: J7AHP_PROTO_BRD; Value: 120E; PCB Footprint: EMIFIL_BLM15A_0402_0-6; Footprint Path: Y:\MIS_DATABASE\Library\ALTIUM_TOOL\PCB_FOOTPRINTS\Altium_Footprint_Lib.PcbLib; Library Path: Y:\MIS_DATABASE\Library\ALTIUM_TOOL\SCHEMATICS_PARTS\MS_FILTER_Library.schlib; MECHANICAL 3D STEP FILE: EMIFIL_BLM15A_0402_0-6; Chkd/date: MANIRAJA/170122; Crtd /date: TAMILARASU/170122; Datasheet: Y:\MIS_DATABASE\DATASHEETS\DISCRETES\INDUCTORS\BLM15-SZ1D-SER.PDF; Temperature: -55°C+125°C; Weight: 1mg; Height: 0.55MM; Library Ref: EMIFILTER_IND; Distributor_part_number: 490-16510-1-ND; Distributor_name: DIGIKEY; Voltage: NA; Footprint Ref: EMIFIL_BLM15A_0402_0-6; Automotive Alternate_mfr_name: TDK; Manufacturer: MURATA
FL87 = EMIFILTER_IND: IND FERRITE BEAD CHIP 120E 700mA 0402; Part Reference: FL87; Part_type: INDUCTOR; Mfr_name: MURATA; Mistral Part No: 130022010017-R; Direct Alternate_mfr_name: TDK; Direct Alternate_mfr_part_number: MPZ1608S121ATAH0; Automotive Alternate_mfr_part_number: MPZ1608S121ATDH5; Custom_Duty: 24%; Customs_HS_Code: 85437099; Wattage: NA; Tolerance: 25%; Project: J7AHP_PROTO_BRD; Value: 120E; PCB Footprint: EMIFIL_BLM15A_0402_0-6; Footprint Path: Y:\MIS_DATABASE\Library\ALTIUM_TOOL\PCB_FOOTPRINTS\Altium_Footprint_Lib.PcbLib; Library Path: Y:\MIS_DATABASE\Library\ALTIUM_TOOL\SCHEMATICS_PARTS\MS_FILTER_Library.schlib; MECHANICAL 3D STEP FILE: EMIFIL_BLM15A_0402_0-6; Chkd/date: MANIRAJA/170122; Crtd /date: TAMILARASU/170122; Datasheet: Y:\MIS_DATABASE\DATASHEETS\DISCRETES\INDUCTORS\BLM15-SZ1D-SER.PDF; Temperature: -55°C+125°C; Weight: 1mg; Height: 0.55MM; Library Ref: EMIFILTER_IND; Distributor_part_number: 490-16510-1-ND; Distributor_name: DIGIKEY; Voltage: NA; Footprint Ref: EMIFIL_BLM15A_0402_0-6; Automotive Alternate_mfr_name: TDK; Manufacturer: MURATA
FL88 = EMIFILTER_IND: IND FERRITE BEAD CHIP 120E 700mA 0402; Part Reference: FL88; Automotive Alternate_mfr_part_number: MPZ1608S121ATDH5; Automotive Alternate_mfr_name: TDK; Direct Alternate_mfr_part_number: MPZ1608S121ATAH0; Mistral Part No: 130022010017-R; Mfr_name: MURATA; Part_type: INDUCTOR; Project: J7AHP_PROTO_BRD; Tolerance: 25%; Voltage: NA; Customs_HS_Code: 85437099; Custom_Duty: 24%; Value: 120E; PCB Footprint: EMIFIL_BLM15A_0402_0-6; Direct Alternate_mfr_name: TDK; Footprint Ref: EMIFIL_BLM15A_0402_0-6; Wattage: NA; Distributor_name: DIGIKEY; Distributor_part_number: 490-16510-1-ND; Library Ref: EMIFILTER_IND; Height: 0.55MM; Weight: 1mg; Temperature: -55°C+125°C; Datasheet: Y:\MIS_DATABASE\DATASHEETS\DISCRETES\INDUCTORS\BLM15-SZ1D-SER.PDF; Crtd /date: TAMILARASU/170122; Chkd/date: MANIRAJA/170122; MECHANICAL 3D STEP FILE: EMIFIL_BLM15A_0402_0-6; Library Path: Y:\MIS_DATABASE\Library\ALTIUM_TOOL\SCHEMATICS_PARTS\MS_FILTER_Library.schlib; Footprint Path: Y:\MIS_DATABASE\Library\ALTIUM_TOOL\PCB_FOOTPRINTS\Altium_Footprint_Lib.PcbLib; Manufacturer: MURATA
FL89 = EMIFILTER_IND: IND FERRITE BEAD CHIP 120E 700mA 0402; Part Reference: FL89; Part_type: INDUCTOR; Mfr_name: MURATA; Mistral Part No: 130022010017-R; Direct Alternate_mfr_name: TDK; Direct Alternate_mfr_part_number: MPZ1608S121ATAH0; Automotive Alternate_mfr_part_number: MPZ1608S121ATDH5; Custom_Duty: 24%; Customs_HS_Code: 85437099; Wattage: NA; Tolerance: 25%; Project: J7AHP_PROTO_BRD; Value: 120E; PCB Footprint: EMIFIL_BLM15A_0402_0-6; Footprint Path: Y:\MIS_DATABASE\Library\ALTIUM_TOOL\PCB_FOOTPRINTS\Altium_Footprint_Lib.PcbLib; Library Path: Y:\MIS_DATABASE\Library\ALTIUM_TOOL\SCHEMATICS_PARTS\MS_FILTER_Library.schlib; MECHANICAL 3D STEP FILE: EMIFIL_BLM15A_0402_0-6; Chkd/date: MANIRAJA/170122; Crtd /date: TAMILARASU/170122; Datasheet: Y:\MIS_DATABASE\DATASHEETS\DISCRETES\INDUCTORS\BLM15-SZ1D-SER.PDF; Temperature: -55°C+125°C; Weight: 1mg; Height: 0.55MM; Library Ref: EMIFILTER_IND; Distributor_part_number: 490-16510-1-ND; Distributor_name: DIGIKEY; Voltage: NA; Footprint Ref: EMIFIL_BLM15A_0402_0-6; Automotive Alternate_mfr_name: TDK; Manufacturer: MURATA
FL90 = EMIFILTER_IND: IND FERRITE BEAD CHIP 120E 700mA 0402; Part Reference: FL90; Part_type: INDUCTOR; Mfr_name: MURATA; Mistral Part No: 130022010017-R; Direct Alternate_mfr_name: TDK; Direct Alternate_mfr_part_number: MPZ1608S121ATAH0; Automotive Alternate_mfr_part_number: MPZ1608S121ATDH5; Custom_Duty: 24%; Customs_HS_Code: 85437099; Wattage: NA; Tolerance: 25%; Project: J7AHP_PROTO_BRD; Value: 120E; PCB Footprint: EMIFIL_BLM15A_0402_0-6; Footprint Path: Y:\MIS_DATABASE\Library\ALTIUM_TOOL\PCB_FOOTPRINTS\Altium_Footprint_Lib.PcbLib; Library Path: Y:\MIS_DATABASE\Library\ALTIUM_TOOL\SCHEMATICS_PARTS\MS_FILTER_Library.schlib; MECHANICAL 3D STEP FILE: EMIFIL_BLM15A_0402_0-6; Chkd/date: MANIRAJA/170122; Crtd /date: TAMILARASU/170122; Datasheet: Y:\MIS_DATABASE\DATASHEETS\DISCRETES\INDUCTORS\BLM15-SZ1D-SER.PDF; Temperature: -55°C+125°C; Weight: 1mg; Height: 0.55MM; Library Ref: EMIFILTER_IND; Distributor_part_number: 490-16510-1-ND; Distributor_name: DIGIKEY; Voltage: NA; Footprint Ref: EMIFIL_BLM15A_0402_0-6; Automotive Alternate_mfr_name: TDK; Manufacturer: MURATA
FL91 = EMIFILTER_IND: IND FERRITE BEAD CHIP 120E 700mA 0402; Part Reference: FL91; Automotive Alternate_mfr_part_number: MPZ1608S121ATDH5; Automotive Alternate_mfr_name: TDK; Direct Alternate_mfr_part_number: MPZ1608S121ATAH0; Mistral Part No: 130022010017-R; Mfr_name: MURATA; Part_type: INDUCTOR; Project: J7AHP_PROTO_BRD; Tolerance: 25%; Voltage: NA; Customs_HS_Code: 85437099; Custom_Duty: 24%; Value: 120E; PCB Footprint: EMIFIL_BLM15A_0402_0-6; Direct Alternate_mfr_name: TDK; Footprint Ref: EMIFIL_BLM15A_0402_0-6; Wattage: NA; Distributor_name: DIGIKEY; Distributor_part_number: 490-16510-1-ND; Library Ref: EMIFILTER_IND; Height: 0.55MM; Weight: 1mg; Temperature: -55°C+125°C; Datasheet: Y:\MIS_DATABASE\DATASHEETS\DISCRETES\INDUCTORS\BLM15-SZ1D-SER.PDF; Crtd /date: TAMILARASU/170122; Chkd/date: MANIRAJA/170122; MECHANICAL 3D STEP FILE: EMIFIL_BLM15A_0402_0-6; Library Path: Y:\MIS_DATABASE\Library\ALTIUM_TOOL\SCHEMATICS_PARTS\MS_FILTER_Library.schlib; Footprint Path: Y:\MIS_DATABASE\Library\ALTIUM_TOOL\PCB_FOOTPRINTS\Altium_Footprint_Lib.PcbLib; Manufacturer: MURATA
FL102 = EMIFILTER_IND: IND FERRITE BEAD CHIP 120E 700mA 0402; Part Reference: FL102; Automotive Alternate_mfr_part_number: MPZ1608S121ATDH5; Automotive Alternate_mfr_name: TDK; Direct Alternate_mfr_part_number: MPZ1608S121ATAH0; Mistral Part No: 130022010017-R; Mfr_name: MURATA; Part_type: INDUCTOR; Project: J7AHP_PROTO_BRD; Tolerance: 25%; Voltage: NA; Customs_HS_Code: 85437099; Custom_Duty: 24%; Value: 120E; PCB Footprint: EMIFIL_BLM15A_0402_0-6; Direct Alternate_mfr_name: TDK; Footprint Ref: EMIFIL_BLM15A_0402_0-6; Wattage: NA; Distributor_name: DIGIKEY; Distributor_part_number: 490-16510-1-ND; Library Ref: EMIFILTER_IND; Height: 0.55MM; Weight: 1mg; Temperature: -55°C+125°C; Datasheet: Y:\MIS_DATABASE\DATASHEETS\DISCRETES\INDUCTORS\BLM15-SZ1D-SER.PDF; Crtd /date: TAMILARASU/170122; Chkd/date: MANIRAJA/170122; MECHANICAL 3D STEP FILE: EMIFIL_BLM15A_0402_0-6; Library Path: Y:\MIS_DATABASE\Library\ALTIUM_TOOL\SCHEMATICS_PARTS\MS_FILTER_Library.schlib; Footprint Path: Y:\MIS_DATABASE\Library\ALTIUM_TOOL\PCB_FOOTPRINTS\Altium_Footprint_Lib.PcbLib; Manufacturer: MURATA
FL193 = RESISTOR_Dup2: RES 0E 1/10W JUMPER 0402; Part Reference: FL193; Part_type: RESISTORS\FIXED; Mfr_part_number: ERJ-2GE0R00X; Mfr_name: PANASONIC-ECG; Mistral Part No: 110018030052-R; Custom_Duty: 15%; Customs_HS_Code: 85332119; Voltage: NA; Project: AEGIS POM; Value: 0E; MECHANICAL 3D STEP FILE: RES0402_0-5; Chkd/date: VASANTHA/061216; Crtd /date: NAVEED/201014; Datasheet: Y:\MIS_DATABASE\DATASHEETS\RESISTORS\PAN-ERJSER_NOV17.PDF; Temperature: -55°C+155°C; Weight: 0.8mg; Height: 0.40MM; Distributor_part_number: P0.0JCT-ND; Distributor_name: DIGIKEY; Package: 0402; Wattage: 1/10W; Tolerance: NA; PCB Footprint: RES0402_0-5
FL194 = RESISTOR_Dup2: RES 0E 1/10W JUMPER 0402; Part Reference: FL194; Mistral Part No: 110018030052-R; Mfr_name: PANASONIC-ECG; Mfr_part_number: ERJ-2GE0R00X; Part_type: RESISTORS\FIXED; Project: AEGIS POM; Tolerance: NA; Customs_HS_Code: 85332119; Custom_Duty: 15%; Value: 0E; Voltage: NA; Wattage: 1/10W; Package: 0402; Distributor_name: DIGIKEY; Distributor_part_number: P0.0JCT-ND; Height: 0.40MM; Weight: 0.8mg; Temperature: -55°C+155°C; Datasheet: Y:\MIS_DATABASE\DATASHEETS\RESISTORS\PAN-ERJSER_NOV17.PDF; Crtd /date: NAVEED/201014; Chkd/date: VASANTHA/061216; MECHANICAL 3D STEP FILE: RES0402_0-5; PCB Footprint: RES0402_0-5
U28 = J7AHPSoC-EVM_BGA1414: IC AM69 SoC EVM MICROPROCESSOR BGA1414; Part Reference: U28; Part_type: ICS\DIGITAL\MICROPROCESSOR; Mfr_name: TEXAS INSTRUMENTS; Mistral Part No: 141230020002; SPLIT_INST: TRUE; SWAP_INFO: (S1+S2+S3+S4+S5+S6+S7+S8+S9+S10+S11+S12+S13+S14+S15+S16+S17+S18+S19+S20+S21+S22+S23+S24+S25+S26); Custom_Duty: 15%; Customs_HS_Code: 85423100; Wattage: NA; Project: TI_J7AHP SK_BRD; Value: XJ784S45AALY; Footprint Path: Y:\MIS_DATABASE\Library\ALTIUM_TOOL\PCB_FOOTPRINTS\Altium_Footprint_Lib.PcbLib; Library Path: Y:\MIS_DATABASE\Library\ALTIUM_TOOL\SCHEMATICS_PARTS\MS_MICROPROCESSOR_Library.schlib; MECHANICAL 3D STEP FILE: BGA1414_31-49_1230X1230_2-7; RoHS: NA; Chkd/date: MANIRAJA/151221; Crtd /date: ALVY/141221; Datasheet: Y:\MIS_DATABASE\DATASHEETS\ICS\DIGITAL\MICROCONTROLLER\J7AHP-SoC-EVM.PDF; Temperature: NA; Weight: NA; Height: 2.70MM; Library Ref: J7AHPSoC-EVM_BGA1414; Distributor_part_number: NA; Distributor_name: NA; Package: BGA1414; Voltage: NA; Tolerance: NA; Mfr_part_number: XJ784S45AALY; Footprint Ref: BGA1414_31-49_1230X1230_2-7; Manufacturer: TEXAS INSTRUMENTS; PCB Footprint: BGA1414_31-49_1230X1230_2-7